# Altium schematic sheet mushroom.SchDoc
size A2
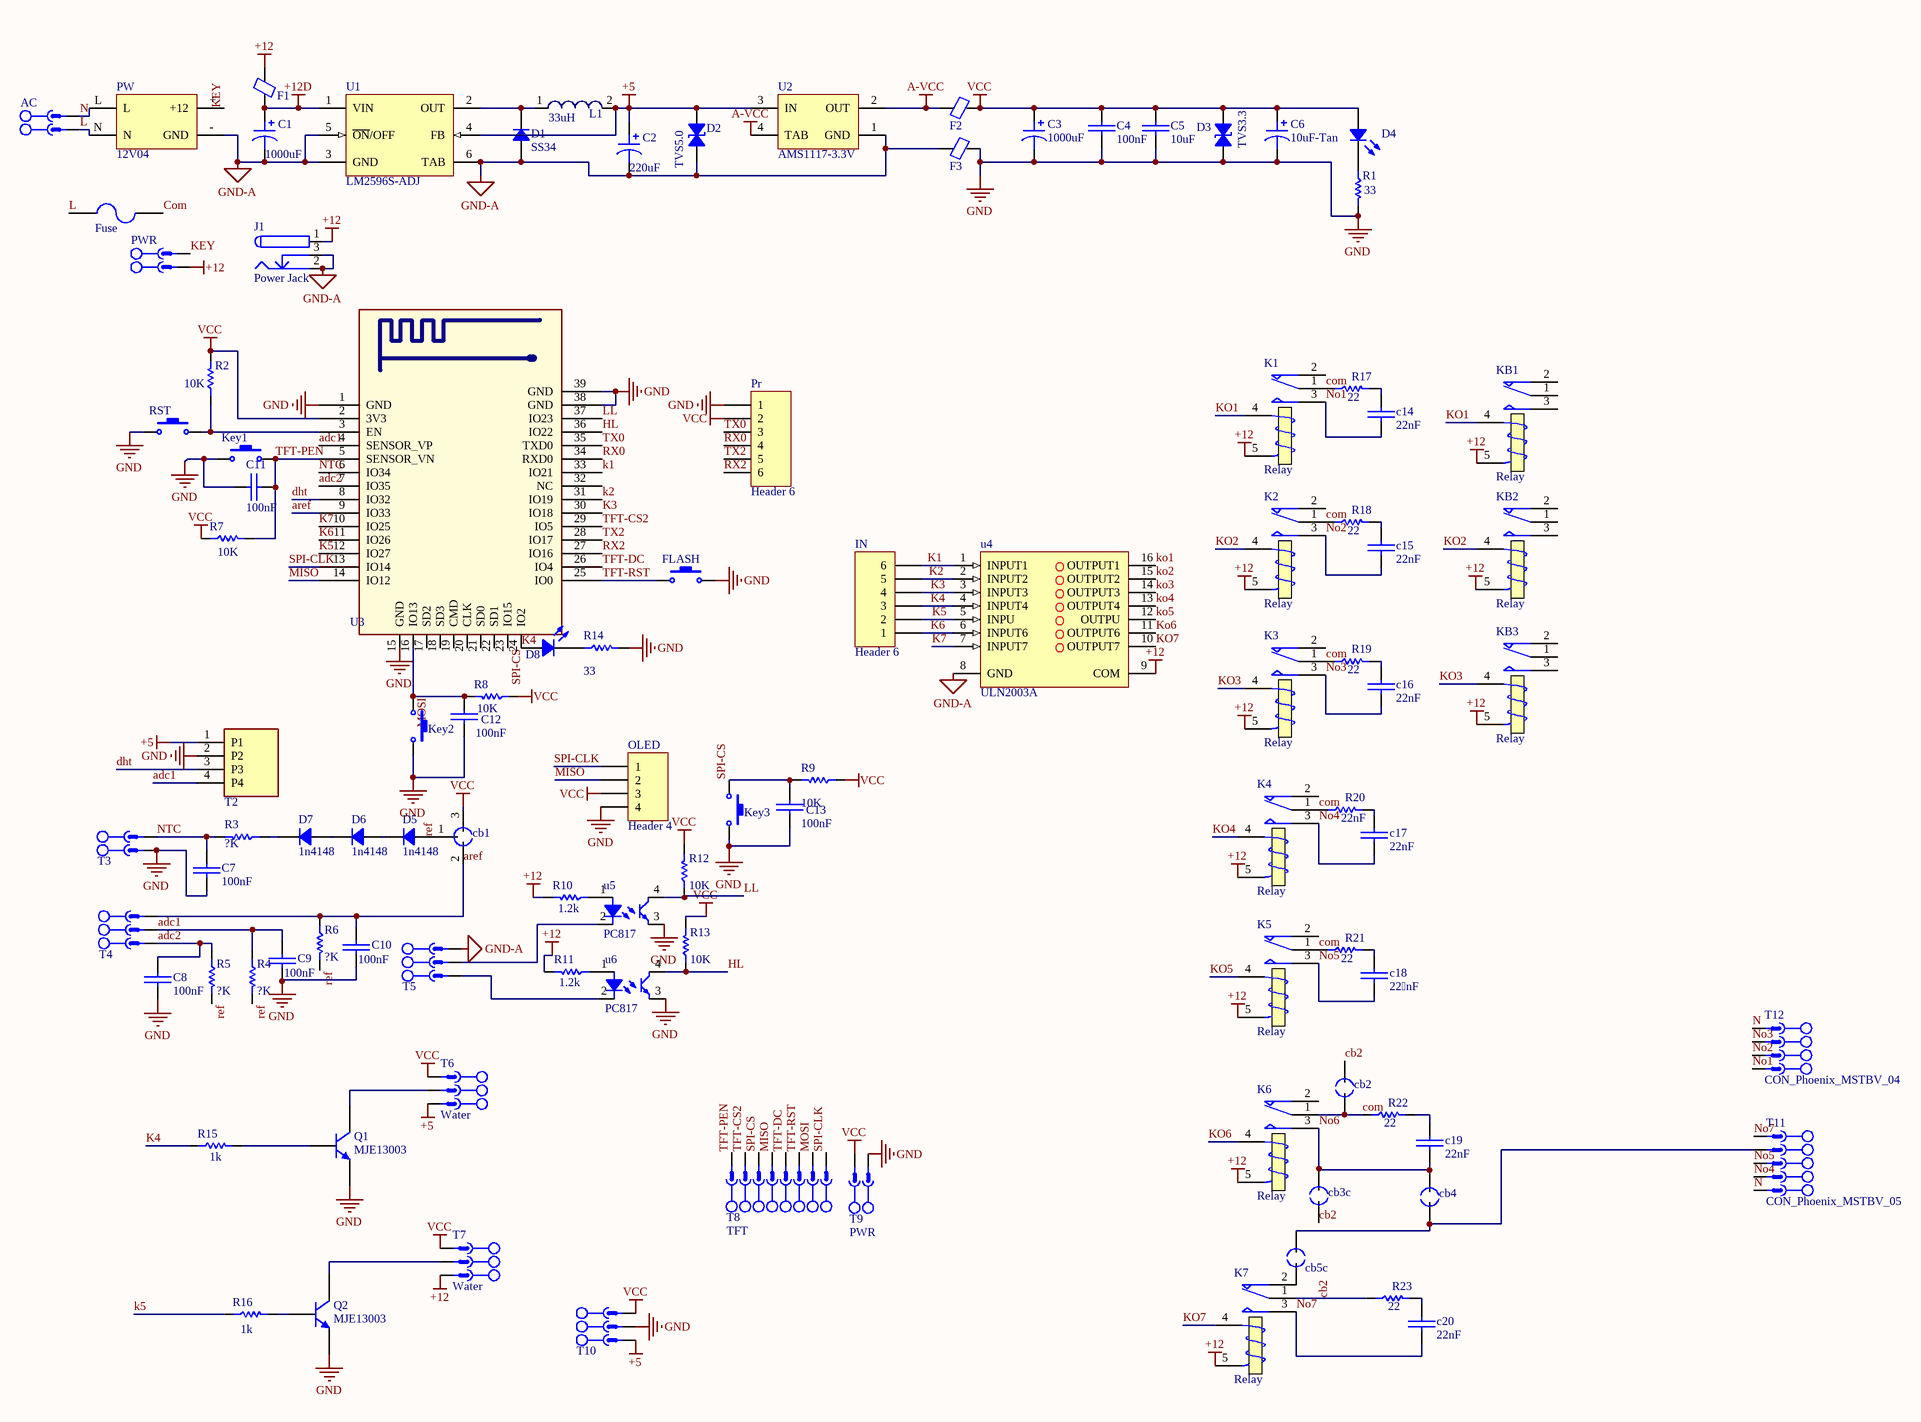
[diagram p0: mushroom.SchDoc]

## Parts
AC  (no value)  [MSTB 2,5/2-G-5,08]
C1  1000uF  [CAP ALSMD POLY 8.3MM H10.5MM]
C2  220uF  [CAP ALSMD POLY 8.3MM H10.5MM]
C3  1000uF  [CAP ALSMD POLY 8.3MM H10.5MM]
C4  100nF  [SMD_CAP_0805]
C5  10uF  [SMD_CAP_0805]
C6  10uF-Tan  [CAPP 1206 (3216X18L) Size A]
C7  100nF  [SMD_CAP_0805]
C8  100nF  [SMD_CAP_0805]
C9  100nF  [SMD_CAP_0805]
C10  100nF  [SMD_CAP_0805]
C11  100nF  [SMD_CAP_0805]
C12  100nF  [SMD_CAP_0805]
C13  100nF  [SMD_CAP_0805]
c14  22nF  [CAP-20]
c15  22nF  [CAP-20]
c16  22nF  [CAP-20]
c17  22nF  [CAP-20]
c18  22nF  [CAP-20]
c19  22nF  [CAP-20]
c20  22nF  [CAP-20]
cb1  (no value)  [CoffeBean 2w]
cb2  (no value)  [CoffeBean]
cb3c  (no value)  [CoffeBean]
cb4  (no value)  [CoffeBean]
cb5c  (no value)  [CoffeBean]
D1  SS34  [DO214AB SMC]
D2  TVS5.0  [ST DO214AA SMB]
D3  TVS3.3  [ST DO214AA SMB]
D4  (no value)  [LED 0805_2012 RED]
D5  1n4148  [SOD-80 MiniMELF]
D6  1n4148  [SOD-80 MiniMELF]
D7  1n4148  [SOD-80 MiniMELF]
D8  (no value)  [LED 0805_2012 RED]
F1  Ferrite Bead SMD  [FB0805]  (value not drawn)
F2  Ferrite Bead SMD  [FB0805]  (value not drawn)
F3  Ferrite Bead SMD  [FB0805]  (value not drawn)
FLASH  Switch PB  [TE FSMSMTR]  (value not drawn)
Fuse  F=1.0 A  [FUSAD2722W65L2250D600]  (value not drawn)
IN  Header 6  [HDR1X6]
J1  Power Jack  [Power Jack]
K1  Relay  [Relay mini milon]
K2  Relay  [Relay mini milon]
K3  Relay  [Relay mini milon]
K4  Relay  [Relay mini milon]
K5  Relay  [Relay mini milon]
K6  Relay  [Relay milon]
K7  Relay  [Relay milon]
KB1  Relay  [Relay-NT90]
KB2  Relay  [Relay-NT90]
KB3  Relay  [Relay-NT90]
Key1  Switch PB  [TE FSMSMTR]  (value not drawn)
Key2  Switch PB  [TE FSMSMTR]  (value not drawn)
Key3  Switch PB  [TE FSMSMTR]  (value not drawn)
L1  33uH  [BOURNS SRN8040]
OLED  Header 4  [HDR1X4]
Pr  Header 6  [HDR1X6]
PW  12V04  [12V750ma]
PWR  PHOENIX  [MSTB 2,5/2-G-5,08]  (value not drawn)
Q1  MJE13003  [TO-252]
Q2  MJE13003  [TO-252]
R1  33  [RES 0805 (2012X06L)]
R2  10K  [RES 0805 (2012X06L)]
R3  ?K  [RES 0805 (2012X06L)]
R4  ?K  [RES 0805 (2012X06L)]
R5  ?K  [RES 0805 (2012X06L)]
R6  ?K  [RES 0805 (2012X06L)]
R7  10K  [RES 0805 (2012X06L)]
R8  10K  [RES 0805 (2012X06L)]
R9  10K  [RES 0805 (2012X06L)]
R10  1.2k  [RES 0805 (2012X06L)]
R11  1.2k  [RES 0805 (2012X06L)]
R12  10K  [RES 0805 (2012X06L)]
R13  10K  [RES 0805 (2012X06L)]
R14  33  [RES 0805 (2012X06L)]
R15  1k  [RES 0805 (2012X06L)]
R16  1k  [RES 0805 (2012X06L)]
R17  22  [RES 2512 (6331X07L)]
R18  22  [RES 2512 (6331X07L)]
R19  22  [RES 2512 (6331X07L)]
R20  22nF  [RES 2512 (6331X07L)]
R21  22  [RES 2512 (6331X07L)]
R22  22  [RES 2512 (6331X07L)]
R23  22  [RES 2512 (6331X07L)]
RST  Switch PB  [TE FSMSMTR]  (value not drawn)
T2  Rj10  [RJ10]  (value not drawn)
T3  FCI-381-2P  [FCI 06-381-2PIN]  (value not drawn)
T4  FCI-381-3P  [FCI 06-381-3PIN]  (value not drawn)
T5  FCI-381-3P  [FCI 06-381-3PIN]  (value not drawn)
T6  Water  [MSTBV 2,5/3-G-5]
T7  Water  [MSTBV 2,5/3-G-5]
T8  TFT  [FCI 06-381-8PIN]
T9  PWR  [FCI 06-381-2PIN]
T10  FCI-381-3P  [FCI 06-381-3PIN]  (value not drawn)
T11  CON_Phoenix_MSTBV_05  [MSTBV 2,5/5-G-5]
T12  CON_Phoenix_MSTBV_04  [MSTBV 2,5/4-G-5]
U1  LM2596S-ADJ  [TS5B_M]
U2  AMS1117-3.3V  [SOT223-AMS1117]
U3  ESP32-WROOM-32D  [esp32 WROOM-L]  (value not drawn)
u4  ULN2003A  [SO16_M]
u5  PC817  [SMT Gullwing Lead-Form]
u6  PC817  [SMT Gullwing Lead-Form]

## Nets
+5: C2.1 D2.2 L1.2 T2.1(P1) T6.3 T10.1 U1.4(FB) U2.3(IN)
+12: F1.1 J1.1 K1.5(T2) K2.5(T2) K3.5(T2) K4.5(T2) K5.5(T2) K6.5(T2) K7.5(T2) KB1.5(T2) KB2.5(T2) KB3.5(T2) PWR.1 R10.2 R11.2 T7.3 u4.9(COM)
+12D: C1.1 F1.2 U1.1(VIN)
A-VCC: F2.2 U2.2(OUT) U2.4(TAB)
GND: C3.2 C4.1(+) C5.1(+) C6.2 C7.1(+) C8.1(+) C9.2(-) C10.2(-) C11.2(-) C12.1(+) C13.1(+) D3.1 F3.1 FLASH.2 Key1.1 Key2.2 Key3.2 OLED.4 Pr.1 Q1.3(E) Q2.3(E) R1.2 R14.2 RST.1 T2.2(P2) T3.1 T9.1 T10.2 U3.1(GND) U3.15(GND) U3.38(GND) U3.39(GND) u5.3 u6.3
GND-A: C1.2 C2.2 D1.1 D2.1 F3.2 J1.2 J1.3 PW.-(GND) T5.3 U1.3(GND) U1.5(~{ON}/OFF) U1.6(TAB) U2.1(GND) u4.8(GND)
VCC: C3.1 C4.2(-) C5.2(-) C6.1 cb1.3 D3.2 D4.1 F2.1 OLED.3 Pr.2 R2.2 R7.1 R8.1 R9.1 R12.2 R13.2 T6.1 T7.1 T9.2 T10.3 U3.2(3V3)
adc1: C9.1(+) R4.1 T2.4(P4) T4.2 U3.4(SENSOR_VP)
adc2: C8.2(-) R5.1 T4.1 U3.7(IO35)
aref: C10.1(+) cb1.2 R6.1 T4.3 U3.9(IO33)
cb2: cb2.2 cb3c.1 K7.1(COM) R23.1
com: cb2.1 Fuse.2 K1.1(COM) K2.1(COM) K3.1(COM) K4.1(COM) K5.1(COM) K6.1(COM) R17.1 R18.1 R19.1 R20.1 R21.1 R22.1
dht: T2.3(P3) U3.8(IO32)
HL: R13.1 U3.36(IO22) u6.4
K1: IN.6 U3.33(IO21) u4.1(INPUT1)
K2: IN.5 U3.31(IO19) u4.2(INPUT2)
K3: IN.4 U3.30(IO18) u4.3(INPUT3)
K4: D8.1 IN.3 R15.1 U3.24(IO2) u4.4(INPUT4)
k5: IN.2 R16.1 U3.12(IO27) u4.5(INPU)
K6: IN.1 U3.11(IO26) u4.6(INPUT6)
K7: U3.10(IO25) u4.7(INPUT7)
KEY: PW.+(+12) PWR.2
KO1: K1.4(T1) KB1.4(T1) u4.16(OUTPUT1)
KO2: K2.4(T1) KB2.4(T1) u4.15(OUTPUT2)
KO3: K3.4(T1) KB3.4(T1) u4.14(OUTPUT3)
KO4: K4.4(T1) u4.13(OUTPUT4)
KO5: K5.4(T1) u4.12(OUTPU)
KO6: K6.4(T1) u4.11(OUTPUT6)
KO7: K7.4(T1) u4.10(OUTPUT7)
L: AC.1 Fuse.1 PW.N
LL: R12.1 U3.37(IO23) u5.4
MISO: OLED.2 T8.5 U3.14(IO12)
MOSI: C12.2(-) Key2.1 R8.2 T8.2 U3.16(IO13)
N: AC.2 PW.L T11.5 T12.1
No1: c14.2(-) K1.3(NO) T12.4
No2: c15.2(-) K2.3(NO) T12.3
No3: c16.2(-) K3.3(NO) T12.2
No4: c17.2(-) K4.3(NO) T11.4
No5: c18.2(-) K5.3(NO) T11.3
No6: c19.2(-) cb3c.2 cb4.2 K6.3(NO)
No7: c20.2(-) K7.3(NO) T11.1
NTC: C7.2(-) R3.2 T3.2 U3.6(IO34)
ref: cb1.1 D5.1 R4.2 R5.2 R6.2
RX0: Pr.4 U3.34(RXD0)
RX2: Pr.6 U3.27(IO16)
SPI-CLK: OLED.1 T8.1 U3.13(IO14)
SPI-CS: C13.2(-) Key3.1 R9.2 T8.6 U3.23(IO15)
TFT-CS2: T8.7 U3.29(IO5)
TFT-DC: T8.4 U3.26(IO4)
TFT-PEN: C11.1(+) Key1.2 R7.2 T8.8 U3.5(SENSOR_VN)
TFT-RST: FLASH.1 T8.3 U3.25(IO0)
TX0: Pr.3 U3.35(TXD0)
TX2: Pr.5 U3.28(IO17)
Netc14_1: c14.1(+) R17.2
Netc15_1: c15.1(+) R18.2
Netc16_1: c16.1(+) R19.2
Netc17_1: c17.1(+) R20.2
Netc18_1: c18.1(+) R21.2
Netc19_1: c19.1(+) R22.2
Netc20_1: c20.1(+) R23.2
Netcb4_1: cb4.1 cb5c.2 T11.2
Netcb5c_1: cb5c.1 K7.2(NC)
NetD1_2: D1.2 L1.1 U1.2(OUT)
NetD4_2: D4.2 R1.1
NetD5_2: D5.2 D6.1
NetD6_2: D6.2 D7.1
NetD7_2: D7.2 R3.1
NetD8_2: D8.2 R14.1
NetQ1_1: Q1.1(B) R15.2
NetQ1_2: Q1.2(C) T6.2
NetQ2_1: Q2.1(B) R16.2
NetQ2_2: Q2.2(C) T7.2
NetR2_1: R2.1 RST.2 U3.3(EN)
NetR10_1: R10.1 u5.1
NetR11_1: R11.1 u6.1
NetT5_1: T5.1 u6.2
NetT5_2: T5.2 u5.2

Not connected (* = marked no-connect by the designer): K1 2(NC); K2 2(NC); K3 2(NC); K4 2(NC); K5 2(NC); K6 2(NC); KB1 1(COM) 2(NC) 3(NO); KB2 1(COM) 2(NC) 3(NO); KB3 1(COM) 2(NC) 3(NO); U3 17(SD2) 18(SD3) 19(CMD) 20(CLK) 21(SD0) 22(SD1) 32(NC)

## Library data of the parts
AC PWR = CON_Phoenix_MSTB_02: 2 Pitch: 5.08 mm Color: green Contact surface: Tin Assembly; Manufacturer: PHOENIX CONTACT; Connector type: PCB Terminal Block; designer: ABBAS BASEREH; Max Current: 12 A; Positions: 2; Voltage: 320 V; Category: Connector; ComponentLink1Description: Header, Nominal current: 12 A Rated voltage (III/2): 320 V Number of positions: 2 Pitch: 5.08 mm Color: green Contact surface: Tin Assembly: Soldering  DESIGNER:ABBAS BASEREH; ComponentLink2Description: Reference; Mounting Technology: Through-Hole; Pin Count: 2; Revision 1: 2017-3-1; Status: Unreleased; PART.NO: PHOENIX
C1-C3 C6 = Cap Polar
C4 C5 C7-C13 c14-c20 = Cap-Bipolar: Bipolar Capacitor; Voltage: 100V; Designer: Saeid Jorablo; Organazation: ControTec; Adding Date: 1387/12/20
  C4 C7-C13: Value: 100nF
  C5: Value: 10uF
  c14-c17 c19 c20: Value: 22nF
cb1 = Coffe Bean 2: Coffe Bean 2w
cb2 cb3c cb4 cb5c = Coffe Bean
D1 D5-D7 = Diode: Rectifier Diode
D2 D3 = Diode TVS: Zener Diode
D4 D8 = LED: Chip LED
F1-F3 = Ferrite Bead SMD Package: Designer: Ali Hafizi
FLASH Key1-Key3 RST = Switch PB: Push Button Switch
Fuse = Fuse 5x20 with holdeer pins: Fuses 5x20; Designer: Abbas Basereh; Desc.: fuse with holder pins 5x20; Data: 28-12-2016
IN Pr = Header 6: Header, 6-Pin; LatestRevisionDate: 17-Jul-2002; LatestRevisionNote: Re-released for DXP Platform.; Publisher: Altium Limited
J1 = Power Jack: Designer: Saeid Jorablo; Company: Personal; Project Name: Laser; Adding Date: 10/21/2009
K1-K7 KB1-KB3 = Relay: SPDT Relay; Designer: Eng. Saeid Jorablo; Company: E.P.I.L; Design_Date: 2011/10/31
L1 = Inductor smd: SMD Power Inductor WE-LHMI, L=6.8 µH; PartNumber: 74437324068; Inductance: 6.8 µH; PackageReference: WE-LHMI 4020; ComponentLink1Description: Manufacturer URL; ComponentLink1URL: http://www.we-online.com; ComponentLink2Description: Datasheet; ComponentLink2URL: http://katalog.we-online.de/kataloge/eisos/media/pdf/74437324068.pdf
OLED = Header 4: Header, 4-Pin; LatestRevisionDate: 17-Jul-2002; LatestRevisionNote: Re-released for DXP Platform.; Publisher: Altium Limited
PW = 12V04: x.x Volt, 800mA Low-Dropout Linear Regulator, 4-pin SOT-223; PartNumber: LM1117IMP-3.3; Manufacturer: National Semiconductor; PackageTopMarking: XYTT*N05B; PowerWise: N; CompType: LDO IC; Published: 4-Dec-2008; DatasheetVersion: Apr-2006; PackageVersion: revB, Apr-2003; PackageReference: MP04A; Publisher: Altium Limited; PackageDescription: Molded SOT-223, 6.50 x 3.56 x 1.6mm Body, 4 Lead, 2.3mm Pitch; Supplier 1: Farnell; Supplier Part Number 1: 7614123; RoHS: N; PinCount: 4; Code_JEDEC: TO-261-AA; Code_IPC: SOT223-4; ComponentLink1Description: LM1117 Datasheet; ComponentLink1URL: http://www.national.com/ds/LM/LM1117.pdf; ComponentLink2Description: LM1117 Web Page; ComponentLink2URL: http://www.national.com/pf/LM/LM1117.html; ComponentLink3Description: MP04A Package Page; ComponentLink3URL: http://www.national.com/packaging/folders/mp04a.html
Q1 Q2 = NPN: NPN Transistor; Designer: Saeid Jorablo; Company: IPA CO; Last Update Time: 2008/08/04; Value: MJE13003
R1-R23 = Resistor
  R1 R14: VALUE: 33
  R2 R7-R9 R12 R13: VALUE: 10K
  R3-R6: VALUE: ?K
  R10 R11: VALUE: 1.2k
  R15 R16: VALUE: 1k
  R17-R19 R21-R23: VALUE: 22
  R20: VALUE: 22nF
T2 = Rj10: 6 Position 1 Port Right Angle RJ11 Low Profile Filtered EMI/RFI Modular Jack; MP: RJ11-6N-B; MF: TE Connectivity; Availability: Unavailable; SnapEDA_Link: https://www.snapeda.com/parts/RJ11-6N-B/TE%20Connectivity%20Corcom%20Filters/view-part/2771781/?ref=snap; Package: None; Price: None; TE_purchase_URL: https://www.te.com/usa-en/product-6609212-4.html?te_bu=Cor&te_type=disp&te_campaign=seda_glo_cor-seda-global-disp-prtnr-fy19-seda-model-bom-cta_sma-317_1&elqCampaignId=32493; Value: *
T3 T9 = FCI-381-2P: 6 Pitch: 5.08 mm Color: green Contact surface: Tin Assembly; Manufacturer: PHOENIX CONTACT; PART.NO: PHOENIX; Connector type: PCB Terminal Block; designer: ABBAS BASEREH; Max Current: 12 A; Positions: 6; Voltage: 320 V; Category: Connector; ComponentLink1Description: Header, Nominal current: 12 A Rated voltage (III/2): 320 V Number of positions: 6 Pitch: 5.08 mm Color: green Contact surface: Tin Assembly: Soldering  DESIGNER:ABBAS BASEREH; ComponentLink2Description: Reference; Mounting Technology: Through-Hole; Pin Count: 6; Revision 1: 2017-3-1; Status: Unreleased
T4-T7 T10 = FCI-381-3P: 6 Pitch: 5.08 mm Color: green Contact surface: Tin Assembly; Manufacturer: PHOENIX CONTACT; PART.NO: PHOENIX; Connector type: PCB Terminal Block; designer: ABBAS BASEREH; Max Current: 12 A; Positions: 6; Voltage: 320 V; Category: Connector; ComponentLink1Description: Header, Nominal current: 12 A Rated voltage (III/2): 320 V Number of positions: 6 Pitch: 5.08 mm Color: green Contact surface: Tin Assembly: Soldering  DESIGNER:ABBAS BASEREH; ComponentLink2Description: Reference; Mounting Technology: Through-Hole; Pin Count: 6; Revision 1: 2017-3-1; Status: Unreleased
T8 = FCI-381-8P: 6 Pitch: 5.08 mm Color: green Contact surface: Tin Assembly; Manufacturer: PHOENIX CONTACT; PART.NO: PHOENIX; Connector type: PCB Terminal Block; designer: ABBAS BASEREH; Max Current: 12 A; Positions: 6; Voltage: 320 V; Category: Connector; ComponentLink1Description: Header, Nominal current: 12 A Rated voltage (III/2): 320 V Number of positions: 6 Pitch: 5.08 mm Color: green Contact surface: Tin Assembly: Soldering  DESIGNER:ABBAS BASEREH; ComponentLink2Description: Reference; Mounting Technology: Through-Hole; Pin Count: 6; Revision 1: 2017-3-1; Status: Unreleased
T11 = CON_Phoenix_MSTBV_05: 5 Pitch: 5 mm Color: green Contact surface: Tin Assembly; Manufacturer: PHOENIX CONTACT; Connector type: PCB Terminal Block; designer: ABBAS BASEREH; Max Current: 12 A; Positions: 5; Voltage: 320 V; Category: Connector; ComponentLink1Description: Header, Nominal current: 12 A Rated voltage (III/2): 320 V Number of positions: 5 Pitch: 5 mm Color: green Contact surface: Tin Assembly: Soldering  DESIGNER:ABBAS BASEREH; ComponentLink2Description: Reference; Mounting Technology: Through-Hole; Pin Count: 5; Revision 1: 2017-3-1; Status: Unreleased; PART.NO: PHOENIX
T12 = CON_Phoenix_MSTBV_04: 4 Pitch: 5 mm Color: green Contact surface: Tin Assembly; Manufacturer: PHOENIX CONTACT; Connector type: PCB Terminal Block; designer: ABBAS BASEREH; Max Current: 12 A; Positions: 4; Voltage: 320 V; Category: Connector; ComponentLink1Description: Header, Nominal current: 12 A Rated voltage (III/2): 320 V Number of positions: 4 Pitch: 5 mm Color: green Contact surface: Tin Assembly: Soldering  DESIGNER:ABBAS BASEREH; ComponentLink2Description: Reference; Mounting Technology: Through-Hole; Pin Count: 4; Revision 1: 2017-3-1; Status: Unreleased; PART.NO: PHOENIX
U1 = LM2596S-ADJ: SIMPLE SWITCHER® Power Converter 150 KHz 3A Step-Down Voltage Regulator, 5-pin TO-263; Manufacturer: National Semiconductor; PackageTopMarking: NSUZXYTTE#*LM2596S*-ADJ P+; PowerWise: N; High-Reliability: Y; DatasheetVersion: May-2002; PackageVersion: revD, Apr-2005; PackageReference: TS5B; PackageDescription: TO-263, Molded, .400 x .390 x .180in, 5 Lead, .067in Pitch, Surface Mount; PartNumber: LM2596S-ADJ; RoHS: N; PinCount: 5; CompType: Switcher; Code_JEDEC: MO-169-AB; ComponentLink1Description: Manufacturer URL; ComponentLink1URL: http://www.national.com/; ComponentLink2Description: LM2596 Datasheet; ComponentLink2URL: http://www.national.com/ds/LM/LM2596.pdf; ComponentLink3Description: LM2596 Web Page; ComponentLink3URL: http://www.national.com/pf/LM/LM2596.html; ComponentLink4Description: TS5B Package Page; ComponentLink4URL: http://www.national.com/packaging/folders/ts5b.html
U2 = AMS1117IMP-x.x_1: x.x Volt, 800mA Low-Dropout Linear Regulator, 4-pin SOT-223; PartNumber: LM1117IMP-3.3; Manufacturer: National Semiconductor; PackageTopMarking: XYTT*N05B; PowerWise: N; CompType: LDO IC; Published: 4-Dec-2008; DatasheetVersion: Apr-2006; PackageVersion: revB, Apr-2003; PackageReference: MP04A; Publisher: Altium Limited; PackageDescription: Molded SOT-223, 6.50 x 3.56 x 1.6mm Body, 4 Lead, 2.3mm Pitch; Supplier 1: Farnell; Supplier Part Number 1: 7614123; RoHS: N; PinCount: 4; Code_JEDEC: TO-261-AA; Code_IPC: SOT223-4; ComponentLink1Description: LM1117 Datasheet; ComponentLink1URL: http://www.national.com/ds/LM/LM1117.pdf; ComponentLink2Description: LM1117 Web Page; ComponentLink2URL: http://www.national.com/pf/LM/LM1117.html; ComponentLink3Description: MP04A Package Page; ComponentLink3URL: http://www.national.com/packaging/folders/mp04a.html
U3 = ESP32-WROOM-32D: IC: SoC; GPIO, I2C, I2S, IR, SD, SDIO, SPI, UART; 2.7Ã·3.6VDC; 20dBm; MF: Espressif Systems; Package: Module Espressif Systems; Price: None; Availability: Unavailable; MP: ESP32-WROOM-32D; SnapEDA_Link: https://www.snapeda.com/parts/ESP32-WROOM-32D/Espressif%20Systems/view-part/?ref=snap; Value: *
u4 = ULN2003A: SEVEN DARLINGTON ARRAYS; Published: 2017-3-2; DatasheetVersion: STMicroelectronics GROUP OF COMPANIES; PackageVersion: 2017-3-2; PackageReference: SO16_N; Publisher: Abbas Basereh; PackageDescription: 16-Pin Small Outline Integrated Circuit 1.27 mm Pitch, IPC High Density; Supplier 1: Digi-Key; Supplier Part Number 1: ULN2003A; Supplier 2: Mouser; Supplier Part Number 2: ULN2003A; ComponentLink1Description: Datasheet; ComponentLink2URL: http://www.st.com
u5 u6 = Optoisolator